# EAGLE design Track Controller (EAGLE 9.1.3)

## Sheet 1 of 2
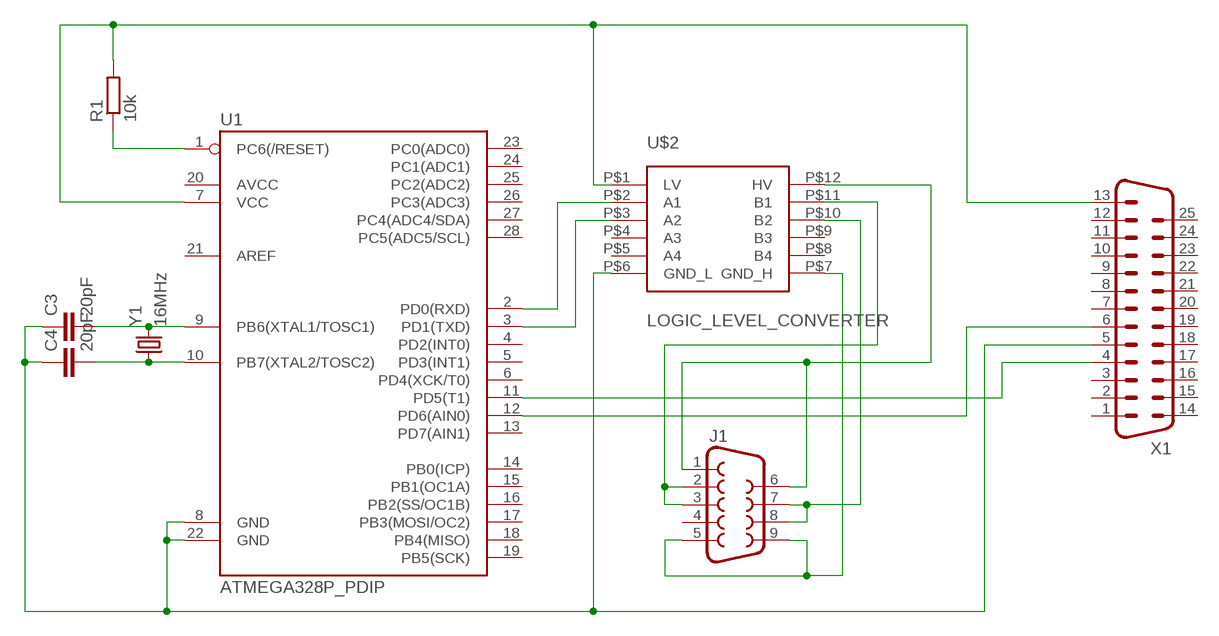
[diagram p0: schematic, sheet 1]

### Parts
C3  20pF  CAPPTH1  [CAP-PTH-5MM]
C4  20pF  CAPPTH1  [CAP-PTH-5MM]
J1  DB9FEMALE  [DB9]
R1  10k  R-EU_0204/7  [0204/7]
U1  ATMEGA328P_PDIP  [DIL28-3]
U$2  LOGIC_LEVEL_CONVERTER  [LOGIC_LEVEL_CONVERTER]
X1  DB25H  [M25H]
Y1  16MHz  CRYSTALHC49US  [HC49US]

### Nets
N$1: R1.2 U1.7(VCC) U$2.P$1(LV) X1.13
N$2: C3.1 C4.1 U1.8(GND) U1.22(GND) U$2.P$6(GND_L) X1.5
N$3: U1.12(PD6(AIN0)) X1.6
N$4: U1.11(PD5(T1)) X1.4
N$5: U1.2(PD0(RXD)) U$2.P$2(A1)
N$6: U1.3(PD1(TXD)) U$2.P$3(A2)
N$7: J1.7 J1.8 U$2.P$10(B2)
N$8: J1.1 J1.6 U$2.P$12(HV)
N$9: J1.5 J1.9 U$2.P$7(GND_H)
N$10: R1.1 U1.1(PC6(/RESET))
N$11: J1.2 J1.3 U$2.P$11(B1)
N$12: C3.2 U1.9(PB6(XTAL1/TOSC1)) Y1.2
N$13: C4.2 U1.10(PB7(XTAL2/TOSC2)) Y1.1
Unconnected: J1.4 U1.4(PD2(INT0)) U1.5(PD3(INT1)) U1.6(PD4(XCK/T0)) U1.13(PD7(AIN1)) U1.14(PB0(ICP)) U1.15(PB1(OC1A)) U1.16(PB2(SS/OC1B)) U1.17(PB3(MOSI/OC2)) U1.18(PB4(MISO)) U1.19(PB5(SCK)) U1.20(AVCC) U1.21(AREF) U1.23(PC0(ADC0)) U1.24(PC1(ADC1)) U1.25(PC2(ADC2)) U1.26(PC3(ADC3)) U1.27(PC4(ADC4/SDA)) U1.28(PC5(ADC5/SCL)) U$2.P$4(A3) U$2.P$5(A4) U$2.P$8(B4) U$2.P$9(B3) X1.1 X1.2 X1.3 X1.7 X1.8 X1.9 X1.10 X1.11 X1.12 X1.14 X1.15 X1.16 X1.17 X1.18 X1.19 X1.20 X1.21 X1.22 X1.23 X1.24 X1.25

## Sheet 2 of 2
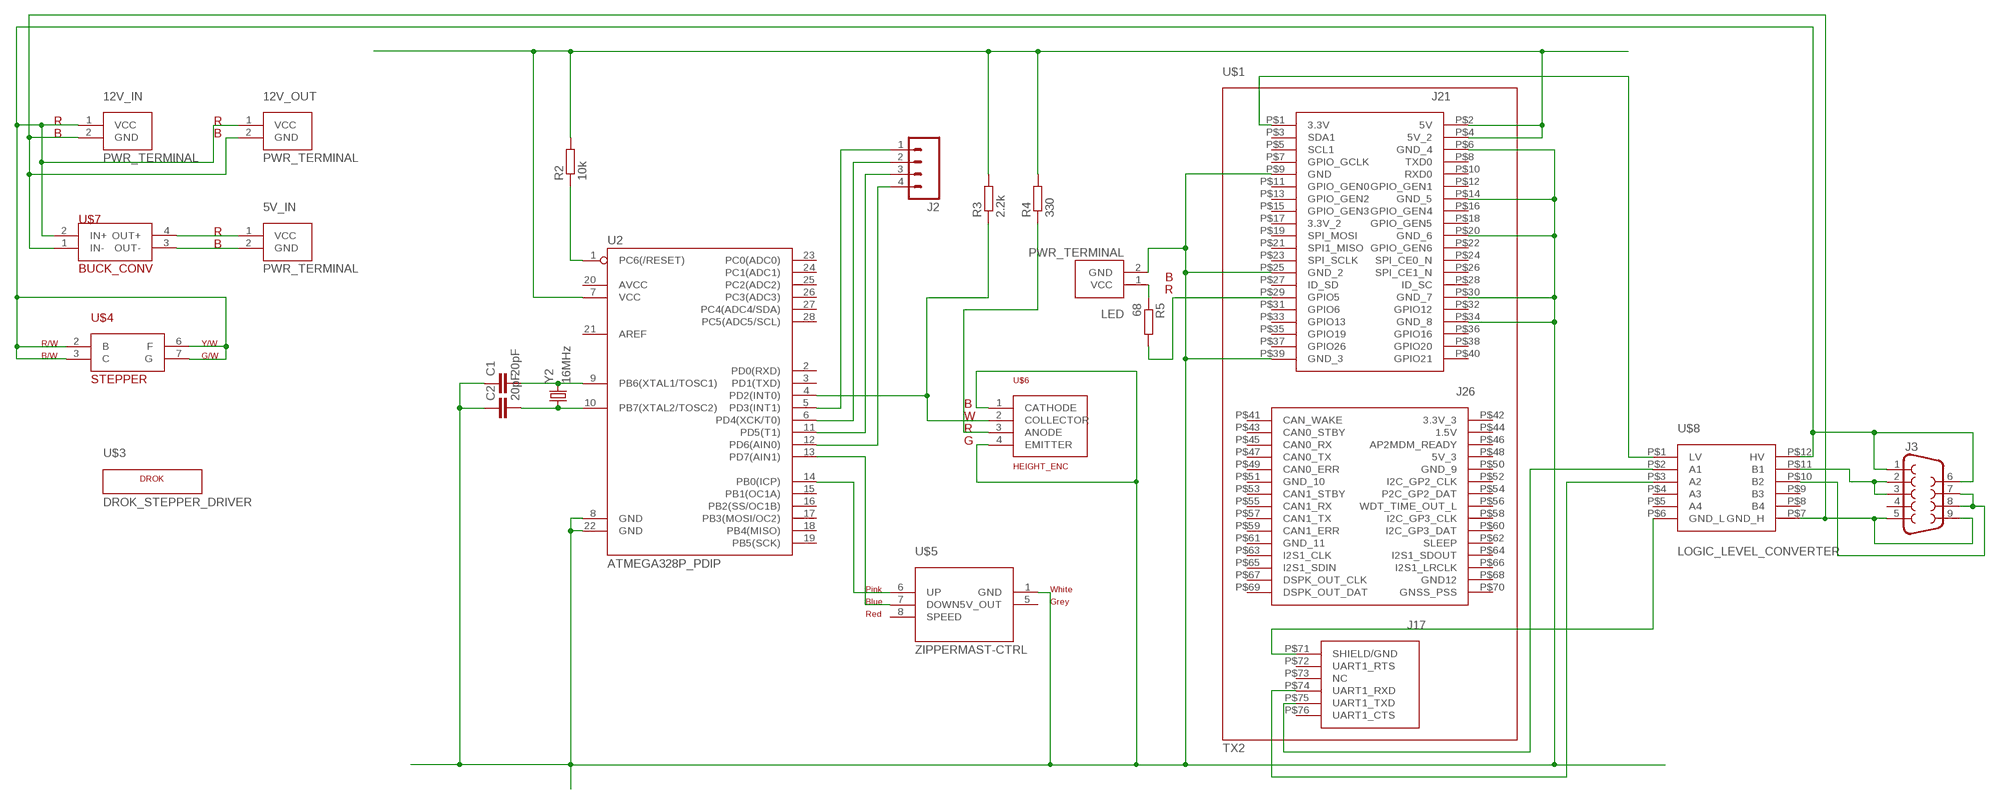
[diagram p1: schematic, sheet 2]

### Parts
5V_IN  PWR_TERMINAL  [PWR_TERMINAL]
12V_IN  PWR_TERMINAL  [PWR_TERMINAL]
12V_OUT  PWR_TERMINAL  [PWR_TERMINAL]
C1  20pF  CAPPTH1  [CAP-PTH-5MM]
C2  20pF  CAPPTH1  [CAP-PTH-5MM]
J2  M04PTH  [1X04]
J3  DB9MALE  [DB9_MALE]
LED  PWR_TERMINAL  [PWR_TERMINAL]
R2  10k  R-EU_0204/7  [0204/7]
R3  2.2k  R-EU_0204/7  [0204/7]
R4  330  R-EU_0204/7  [0204/7]
R5  68  R-EU_0204/7  [0204/7]
U2  ATMEGA328P_PDIP  [DIL28-3]
U$1  TX2  [TX2]
U$3  DROK_STEPPER_DRIVER  [DROK_STEPPER_DRIVER]
U$4  STEPPER  [STEPPER]
U$5  ZIPPERMAST-CTRL  [ZIPPERMAST-CTRL]
U$6  HEIGHT_ENC  [HEIGHT_ENC]
U$7  BUCK_CONV  [BUCK_CONV]
U$8  LOGIC_LEVEL_CONVERTER  [LOGIC_LEVEL_CONVERTER]
Y2  16MHz  CRYSTALHC49US  [HC49US]

### Nets
N$14: J2.1 U2.5(PD3(INT1))
N$15: R2.2 R3.2 R4.2 U2.7(VCC) U$1.P$2(5V) U$1.P$4(5V_2)
N$16: R2.1 U2.1(PC6(/RESET))
N$17: J2.2 U2.6(PD4(XCK/T0))
N$18: LED.1(VCC) R5.1
N$19: J2.3 U2.11(PD5(T1))
N$20: J2.4 U2.12(PD6(AIN0))
N$21: R3.1 U2.4(PD2(INT0)) U$6.2(COLLECTOR)
N$22: R4.1 U$6.3(ANODE)
N$23: U$1.P$75(UART1_TXD) U$8.P$2(A1)
N$24: 5V_IN.2(GND) U$7.3(OUT-)
N$25: 5V_IN.1(VCC) U$7.4(OUT+)
N$26: U2.13(PD7(AIN1)) U$5.7(DOWN)
N$27: U2.14(PB0(ICP)) U$5.6(UP)
N$28: C1.2 U2.9(PB6(XTAL1/TOSC1)) Y2.2
N$29: U$1.P$74(UART1_RXD) U$8.P$3(A2)
N$30: C2.2 U2.10(PB7(XTAL2/TOSC2)) Y2.1
N$31: C1.1 C2.1 LED.2(GND) U2.8(GND) U2.22(GND) U$1.P$6(GND_4) U$1.P$9(GND) U$1.P$14(GND_5) U$1.P$20(GND_6) U$1.P$25(GND_2) U$1.P$30(GND_7) U$1.P$34(GND_8) U$1.P$39(GND_3) U$5.1(GND) U$6.1(CATHODE) U$6.4(EMITTER)
N$32: R5.2 U$1.P$29(GPIO5)
N$33: U$1.P$1(3.3V) U$8.P$1(LV)
N$34: U$1.P$71(SHIELD/GND) U$8.P$6(GND_L)
N$35: 12V_IN.1(VCC) 12V_OUT.1(VCC) J3.1 J3.6 U$4.2(B) U$4.3(C) U$4.6(F) U$4.7(G) U$7.2(IN+) U$8.P$12(HV)
N$36: 12V_IN.2(GND) 12V_OUT.2(GND) J3.5 J3.9 U$7.1(IN-) U$8.P$7(GND_H)
N$37: J3.7 J3.8 U$8.P$10(B2)
N$38: J3.2 J3.3 U$8.P$11(B1)
Unconnected: J3.4 U2.2(PD0(RXD)) U2.3(PD1(TXD)) U2.15(PB1(OC1A)) U2.16(PB2(SS/OC1B)) U2.17(PB3(MOSI/OC2)) U2.18(PB4(MISO)) U2.19(PB5(SCK)) U2.20(AVCC) U2.21(AREF) U2.23(PC0(ADC0)) U2.24(PC1(ADC1)) U2.25(PC2(ADC2)) U2.26(PC3(ADC3)) U2.27(PC4(ADC4/SDA)) U2.28(PC5(ADC5/SCL)) U$1.P$3(SDA1) U$1.P$5(SCL1) U$1.P$7(GPIO_GCLK) U$1.P$8(TXD0) U$1.P$10(RXD0) U$1.P$11(GPIO_GEN0) U$1.P$12(GPIO_GEN1) U$1.P$13(GPIO_GEN2) U$1.P$15(GPIO_GEN3) U$1.P$16(GPIO_GEN4) U$1.P$17(3.3V_2) U$1.P$18(GPIO_GEN5) U$1.P$19(SPI_MOSI) U$1.P$21(SPI1_MISO) U$1.P$22(GPIO_GEN6) U$1.P$23(SPI_SCLK) U$1.P$24(SPI_CE0_N) U$1.P$26(SPI_CE1_N) U$1.P$27(ID_SD) U$1.P$28(ID_SC) U$1.P$31(GPIO6) U$1.P$32(GPIO12) U$1.P$33(GPIO13) U$1.P$35(GPIO19) U$1.P$36(GPIO16) U$1.P$37(GPIO26) U$1.P$38(GPIO20) U$1.P$40(GPIO21) U$1.P$41(CAN_WAKE) U$1.P$42(3.3V_3) U$1.P$43(CAN0_STBY) U$1.P$44(1.5V) U$1.P$45(CAN0_RX) U$1.P$46(AP2MDM_READY) U$1.P$47(CAN0_TX) U$1.P$48(5V_3) U$1.P$49(CAN0_ERR) U$1.P$50(GND_9) U$1.P$51(GND_10) U$1.P$52(I2C_GP2_CLK) U$1.P$53(CAN1_STBY) U$1.P$54(P2C_GP2_DAT) U$1.P$55(CAN1_RX) U$1.P$56(WDT_TIME_OUT_L) U$1.P$57(CAN1_TX) U$1.P$58(I2C_GP3_CLK) U$1.P$59(CAN1_ERR) U$1.P$60(I2C_GP3_DAT) U$1.P$61(GND_11) U$1.P$62(SLEEP) U$1.P$63(I2S1_CLK) U$1.P$64(I2S1_SDOUT) U$1.P$65(I2S1_SDIN) U$1.P$66(I2S1_LRCLK) U$1.P$67(DSPK_OUT_CLK) U$1.P$68(GND12) U$1.P$69(DSPK_OUT_DAT) U$1.P$70(GNSS_PSS) U$1.P$72(UART1_RTS) U$1.P$73(NC) U$1.P$76(UART1_CTS) U$5.5(5V_OUT) U$5.8(SPEED) U$8.P$4(A3) U$8.P$5(A4) U$8.P$8(B4) U$8.P$9(B3)

## Library data of the parts
5V_IN 12V_IN 12V_OUT LED = 000_CropQuant:PWR_TERMINAL
C1-C4 = 001_SparkFun-Capacitors:CAP: Capacitor Standard 0603 ceramic capacitor, and 0.1" leaded capacitor.
J1 = 001_SparkFun-Connectors:DB9: DB9 Connector Standard DB9 (D-Sub 9) serial connector. Can be used for CAN bus as well as RS485 and RS232. Footprint production proven. Spark Fun Electronics SKU : PRT-00429; PROD_ID: CONN-08194
J2 = 001_SparkFun-Connectors:M04: Header 4 Standard 4-pin 0.1" header. Use with straight break away headers (SKU : PRT-00116), right angle break away headers (PRT-00553), swiss pins (PRT-00743), machine pins (PRT-00117), and female headers (PRT-00115). Molex polarized connector foot print use with SKU : PRT-08231 with associated crimp pins and housings. 1MM SMD Version SKU: PRT-10208; PROD_ID: CONN-09696
J3 = 001_SparkFun-Connectors:DB9: DB9 Connector Standard DB9 (D-Sub 9) serial connector. Can be used for CAN bus as well as RS485 and RS232. Footprint production proven. Spark Fun Electronics SKU : PRT-00429; PROD_ID: CONN-09904
R1-R5 = resistor:R-EU_: RESISTOR, European symbol
U1 U2 = 001_SparkFun-DigitalIC:ATMEGA328P_PDIP: uC used in the Arduino 32kb flash, 1k EEPROM, 2k SRAM This is the through-hole version of this chip.
U$1 = 001_nVidia_Jetson_TX2:TX2
U$2 U$8 = 000_CropQuant:LOGIC_LEVEL_CONVERTER
U$3 = 000_CropQuant:DROK_STEPPER_DRIVER
U$4 = 000_CropQuant:STEPPER
U$5 = 000_CropQuant:ZIPPERMAST-CTRL
U$6 = 000_CropQuant:HEIGHT_ENC
U$7 = 000_CropQuant:BUCK_CONV
X1 = 001_SparkFun-Connectors:DB25: Various DB25 connectors
Y1 Y2 = 001_SparkFun-FreqCtrl:CRYSTAL: Various standard crystals. Proven footprints.

## Board
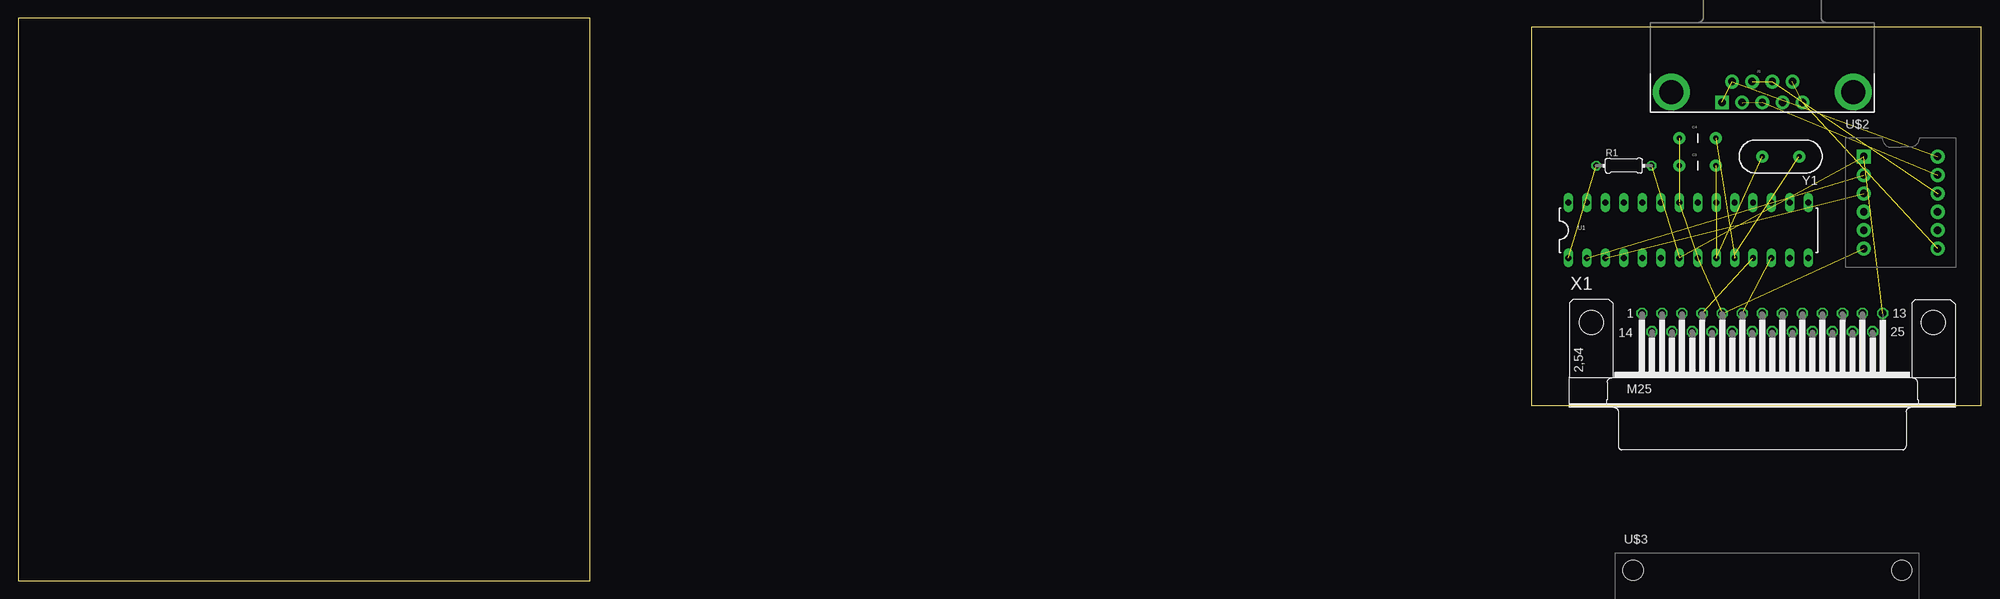
[diagram p2: board, top side]
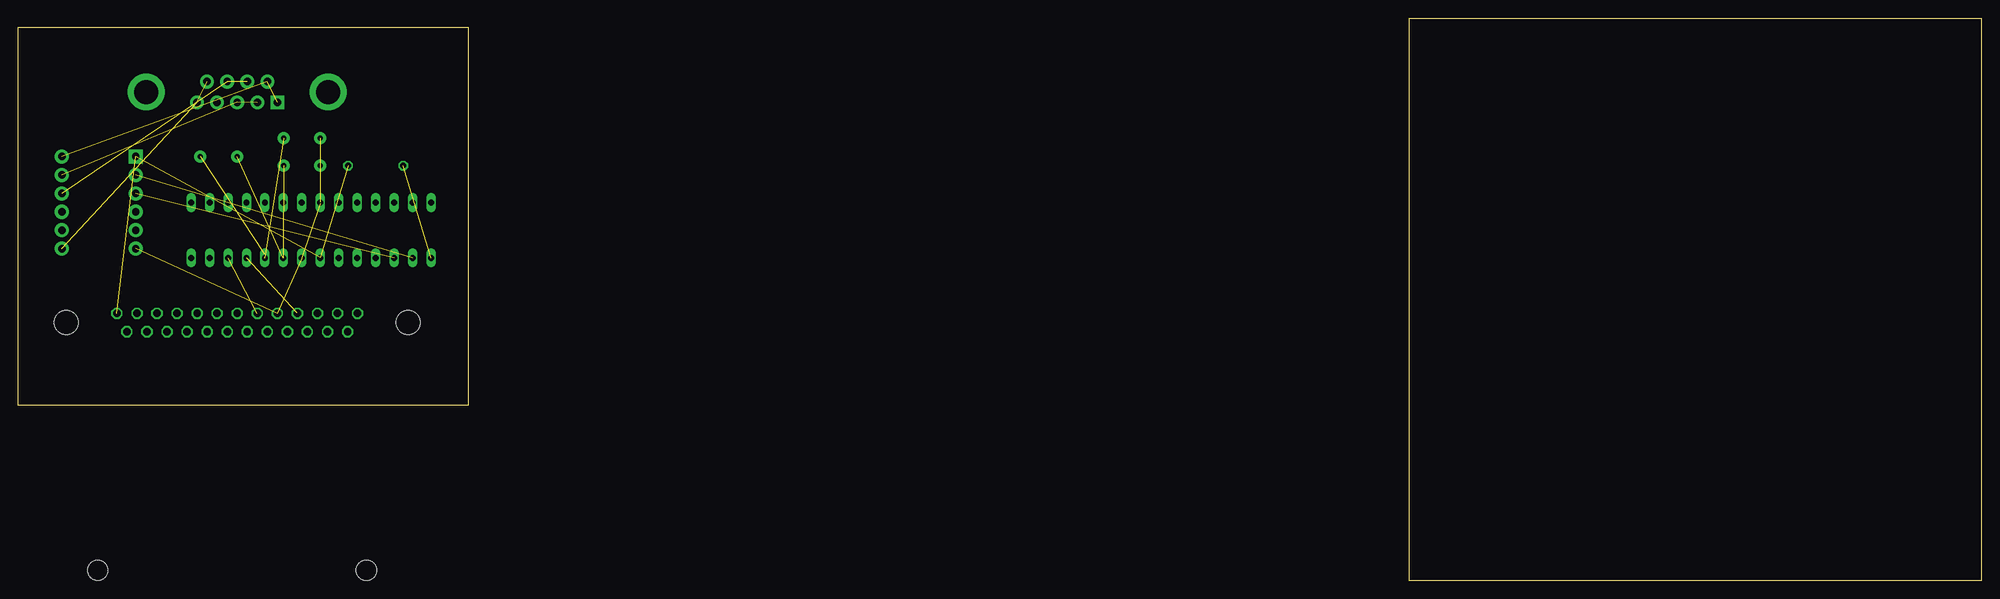
[diagram p3: board, bottom side, seen from below]

Size 270.18 x 77.47 mm. Coordinates in mm from the lower left corner, seen from the top.
Outline: 0,76.2 0,7.62 0,0 78.74,0 78.74,77.47 0,77.47 0,74.93
Outline: 270.18,24.13 270.18,76.19 208.28,76.19 208.28,24.13 270.18,24.13
Copper layers (1*16): Top 0.035mm / dielectric 1.5mm / Bottom 0.035mm
Design rules "default": minimum track width 6mil, minimum drill 0.35mm, track to track 6mil, track to pad 6mil, pad to pad 6mil, via to via 6mil, smd to smd 6mil, copper to edge 40mil, drill to drill 6mil, minimum pad ring 10mil, minimum via ring 8mil, stop-mask expansion 4mil, vias tented up to drill 0mil, thermal gap 10mil

### Footprints (pad centres in the part's own frame; a part is rotated, then mirrored left to right if it is on the bottom)
PWR_TERMINAL = drill 1.3 pad 2.184 square: 1 0,2.54 | drill 1.3 pad 2.184: 2 0,-2.54
CAP-PTH-5MM = drill 0.7 pad 1.651: 1 -2.5,0; 2 2.5,0
DB9 = drill 1.016 pad 1.88 square: 1 -5.54,-1.42 | drill 1.016 pad 1.88: 2 -2.77,-1.42; 3 0,-1.42; 4 2.77,-1.42; 5 5.54,-1.42; 6 -4.15,1.42; 7 -1.38,1.42; 8 1.38,1.42; 9 4.15,1.42 | drill 3.302 pad 5.08: G1 -12.5,0; G2 12.5,0
1X04 = drill 1.016 pad 1.88 square: 1 0,0 | drill 1.016 pad 1.88: 2 2.54,0; 3 5.08,0; 4 7.62,0
DB9_MALE = drill 1.016 pad 1.88: 1 5.54,-1.42; 2 2.77,-1.42; 3 0,-1.42; 4 -2.77,-1.42; 6 4.15,1.42; 7 1.38,1.42; 8 -1.38,1.42; 9 -4.15,1.42 | drill 1.016 pad 1.88 square: 5 -5.54,-1.42 | drill 3.302 pad 5.08: G1 -12.5,0; G2 12.5,0
0204/7 = drill 0.813 octagon: 1 -3.81,0; 2 3.81,0
DIL28-3 = drill 0.813 long: 1 -16.51,-3.81; 2 -13.97,-3.81; 3 -11.43,-3.81; 4 -8.89,-3.81; 5 -6.35,-3.81; 6 -3.81,-3.81; 7 -1.27,-3.81; 8 1.27,-3.81; 9 3.81,-3.81; 10 6.35,-3.81; 11 8.89,-3.81; 12 11.43,-3.81; 13 13.97,-3.81; 14 16.51,-3.81; 15 16.51,3.81; 16 13.97,3.81; 17 11.43,3.81; 18 8.89,3.81; 19 6.35,3.81; 20 3.81,3.81; 21 1.27,3.81; 22 -1.27,3.81; 23 -3.81,3.81; 24 -6.35,3.81; 25 -8.89,3.81; 26 -11.43,3.81; 27 -13.97,3.81; 28 -16.51,3.81
TX2 = drill 1.016 pad 1.93 square: P$1 -15.24,-13.97; P$41 46.99,38.1; P$71 -29.21,-13.97 | drill 1.016 pad 1.93: P$2 -15.24,-11.43; P$3 -12.7,-13.97; P$4 -12.7,-11.43; P$5 -10.16,-13.97; P$6 -10.16,-11.43; P$7 -7.62,-13.97; P$8 -7.62,-11.43; P$9 -5.08,-13.97; P$10 -5.08,-11.43; P$11 -2.54,-13.97; P$12 -2.54,-11.43; P$13 0,-13.97; P$14 0,-11.43; P$15 2.54,-13.97; P$16 2.54,-11.43; P$17 5.08,-13.97; P$18 5.08,-11.43; P$19 7.62,-13.97; P$20 7.62,-11.43; P$21 10.16,-13.97; P$22 10.16,-11.43; P$23 12.7,-13.97; P$24 12.7,-11.43; P$25 15.24,-13.97; P$26 15.24,-11.43; P$27 17.78,-13.97; P$28 17.78,-11.43; P$29 20.32,-13.97; P$30 20.32,-11.43; P$31 22.86,-13.97; P$32 22.86,-11.43; P$33 25.4,-13.97; P$34 25.4,-11.43; P$35 27.94,-13.97; P$36 27.94,-11.43; P$37 30.48,-13.97; P$38 30.48,-11.43; P$39 33.02,-13.97; P$40 33.02,-11.43; P$42 49.53,38.1; P$43 46.99,35.56; P$44 49.53,35.56; P$45 46.99,33.02; P$46 49.53,33.02; P$47 46.99,30.48; P$48 49.53,30.48; P$49 46.99,27.94; P$50 49.53,27.94; P$51 46.99,25.4; P$52 49.53,25.4; P$53 46.99,22.86; P$54 49.53,22.86; P$55 46.99,20.32; P$56 49.53,20.32; P$57 46.99,17.78; P$58 49.53,17.78; P$59 46.99,15.24; P$60 49.53,15.24; P$61 46.99,12.7; P$62 49.53,12.7; P$63 46.99,10.16; P$64 49.53,10.16; P$65 46.99,7.62; P$66 49.53,7.62; P$67 46.99,5.08; P$68 49.53,5.08; P$69 46.99,2.54; P$70 49.53,2.54; P$72 -29.21,-11.43; P$73 -29.21,-8.89; P$74 -29.21,-6.35; P$75 -29.21,-3.81; P$76 -29.21,-1.27
LOGIC_LEVEL_CONVERTER = drill 1.016 pad 1.93 square: P$1 -5.08,6.35 | drill 1.016 pad 1.93: P$2 -5.08,3.81; P$3 -5.08,1.27; P$4 -5.08,-1.27; P$5 -5.08,-3.81; P$6 -5.08,-6.35; P$7 5.08,-6.35; P$8 5.08,-3.81; P$9 5.08,-1.27; P$10 5.08,1.27; P$11 5.08,3.81; P$12 5.08,6.35
DROK_STEPPER_DRIVER = hole 2.8: -19.05,-17.78; 17.95,19.22; 17.95,-17.78; -19.05,19.22
STEPPER = drill 1.3 pad 2.184 square: 2 0,7.62 | drill 1.3 pad 2.184: 3 0,2.54; 6 0,-2.54; 7 0,-7.62
ZIPPERMAST-CTRL = drill 1.3 pad 2.184 square: 1 0,17.78 | drill 1.3 pad 2.184: 2 0,12.7; 3 0,7.62; 4 0,2.54; 5 0,-2.54; 6 0,-7.62; 7 0,-12.7; 8 0,-17.78
HEIGHT_ENC = drill 1.3 pad 2.184 square: 1 0,7.62 | drill 1.3 pad 2.184: 2 0,2.54; 3 0,-2.54; 4 0,-7.62
BUCK_CONV = drill 0.8 pad 2.184 square: 1 -8.89,16.51 | drill 0.8 pad 2.184: 2 8.89,16.51; 3 -8.89,-22.86; 4 8.89,-22.86
M25H = drill 1.016 octagon: 1 -16.561,1.27; 2 -13.792,1.27; 3 -11.049,1.27; 4 -8.28,1.27; 5 -5.512,1.27; 6 -2.769,1.27; 7 0,1.27; 8 2.769,1.27; 9 5.512,1.27; 10 8.28,1.27; 11 11.049,1.27; 12 13.792,1.27; 13 16.561,1.27; 14 -15.189,-1.27; 15 -12.421,-1.27; 16 -9.652,-1.27; 17 -6.909,-1.27; 18 -4.14,-1.27; 19 -1.372,-1.27; 20 1.372,-1.27; 21 4.14,-1.27; 22 6.909,-1.27; 23 9.652,-1.27; 24 12.421,-1.27; 25 15.189,-1.27 | hole 3.302: 23.52,0; -23.52,0
HC49US = drill 0.7 pad 1.651: 1 -2.54,0; 2 2.54,0

### Placement (x,y rotation side)
5V_IN  71.12,-87.63 0 top  (outside the outline)
12V_IN  93.98,-87.63 0 top  (outside the outline)
12V_OUT  82.55,-87.63 0 top  (outside the outline)
C1  212.09,-62.23 0 top  (outside the outline)
C2  212.09,-66.04 0 top  (outside the outline)
C3  231.14,57.15 0 top
C4  231.14,60.96 0 top
J1  240.03,67.31 0 top
J2  125.73,-85.09 0 top  (outside the outline)
J3  52.07,-118.11 0 top  (outside the outline)
LED  59.69,-87.63 0 top  (outside the outline)
R1  220.98,57.15 0 top
R2  213.36,-80.01 0 top  (outside the outline)
R3  128.27,-90.17 0 top  (outside the outline)
R4  128.27,-95.25 0 top  (outside the outline)
R5  58.42,-100.33 0 top  (outside the outline)
U1  229.87,48.26 0 top
U2  227.33,-54.61 0 top  (outside the outline)
U$1  241.3,-31.75 0 top
U$2  259.08,52.07 0 top
U$3  241.3,-17.78 0 top
U$4  154.94,-67.31 0 top  (outside the outline)
U$5  139.7,-55.88 0 top  (outside the outline)
U$6  127,-67.31 0 top  (outside the outline)
U$7  110.49,-67.31 0 top  (outside the outline)
U$8  44.45,-88.9 0 top  (outside the outline)
X1  240.03,35.56 0 top
Y1  242.57,58.42 180 top
Y2  214.63,-72.39 0 top  (outside the outline)

### Tracks (layer width: path | path; a pad name or v marks a point on that pad's centre or on a via)
N$1  (3 unrouted)
  Bottom 0.152: 228.6,44.5 U1.7 228.6,44.35
N$2  (5 unrouted)
  Top 0.152: 228.6,51.97 U1.22 228.6,52.12
  Bottom 0.152: 231.19,44.35 U1.8
N$3  (1 unrouted)
N$4  (1 unrouted)
  Top 0.152: 231.8,36.88 X1.4
N$5  (1 unrouted)
N$6  (1 unrouted)
N$7  (2 unrouted)
  Top 0.152: J1.7 | J1.8
N$8  (2 unrouted)
N$9  (2 unrouted)
  Top 0.152: 245.52,65.99 J1.5
N$10  (1 unrouted)
N$11  (2 unrouted)
  Top 0.152: 237.29,65.84 J1.2
N$12  (2 unrouted)
  Top 0.152: 240.03,58.37 Y1.2
N$13  (3 unrouted)
  Bottom 0.152: 236.22,44.96 236.22,44.5 | 245.06,58.37 Y1.1
N$14  (1 unrouted)
N$15  (5 unrouted)
N$16  (1 unrouted)
N$17  (1 unrouted)
N$18  (1 unrouted)
N$19  (1 unrouted)
N$20  (1 unrouted)
N$21  (2 unrouted)
N$22  (1 unrouted)
N$23  (1 unrouted)
N$24  (1 unrouted)
N$25  (1 unrouted)
N$26  (1 unrouted)
N$27  (1 unrouted)
N$28  (2 unrouted)
N$29  (1 unrouted)
N$30  (2 unrouted)
N$31  (15 unrouted)
N$32  (1 unrouted)
N$33  (1 unrouted)
N$34  (1 unrouted)
N$35  (9 unrouted)
N$36  (5 unrouted)
N$37  (2 unrouted)
N$38  (2 unrouted)